# EAGLE design oled_i2c (EAGLE 6.5.0)
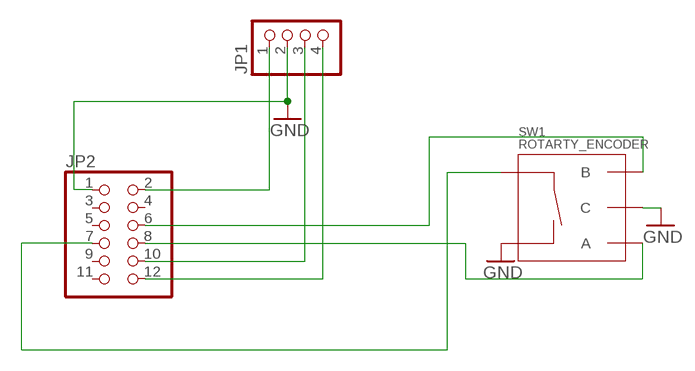
[diagram p0: schematic, sheet 1]

## Parts
JP1  PINHD-1X4  [1X04]
JP2  PINHD-2X6  [2X06]
SW1  ROTARTY_ENCODER  [ROTARY_ENC_PLAIN]

## Nets
GND: JP1.2 JP2.1 SW1.C SW1.SW-
N$1: JP2.7 SW1.SW+
N$2: JP1.1 JP2.2
N$3: JP1.3 JP2.10
N$4: JP1.4 JP2.12
N$6: JP2.6 SW1.B
N$7: JP2.8 SW1.A
Unconnected: JP2.3 JP2.4 JP2.5 JP2.9 JP2.11

## Library data of the parts
JP1 = pinhead:PINHD-1X4: PIN HEADER
JP2 = pinhead:PINHD-2X6: PIN HEADER
SW1 = SparkFun-Electromechanical:ROTARTY_ENCODER: Simple no LED rotary encoder Example: COM-09117

## Board
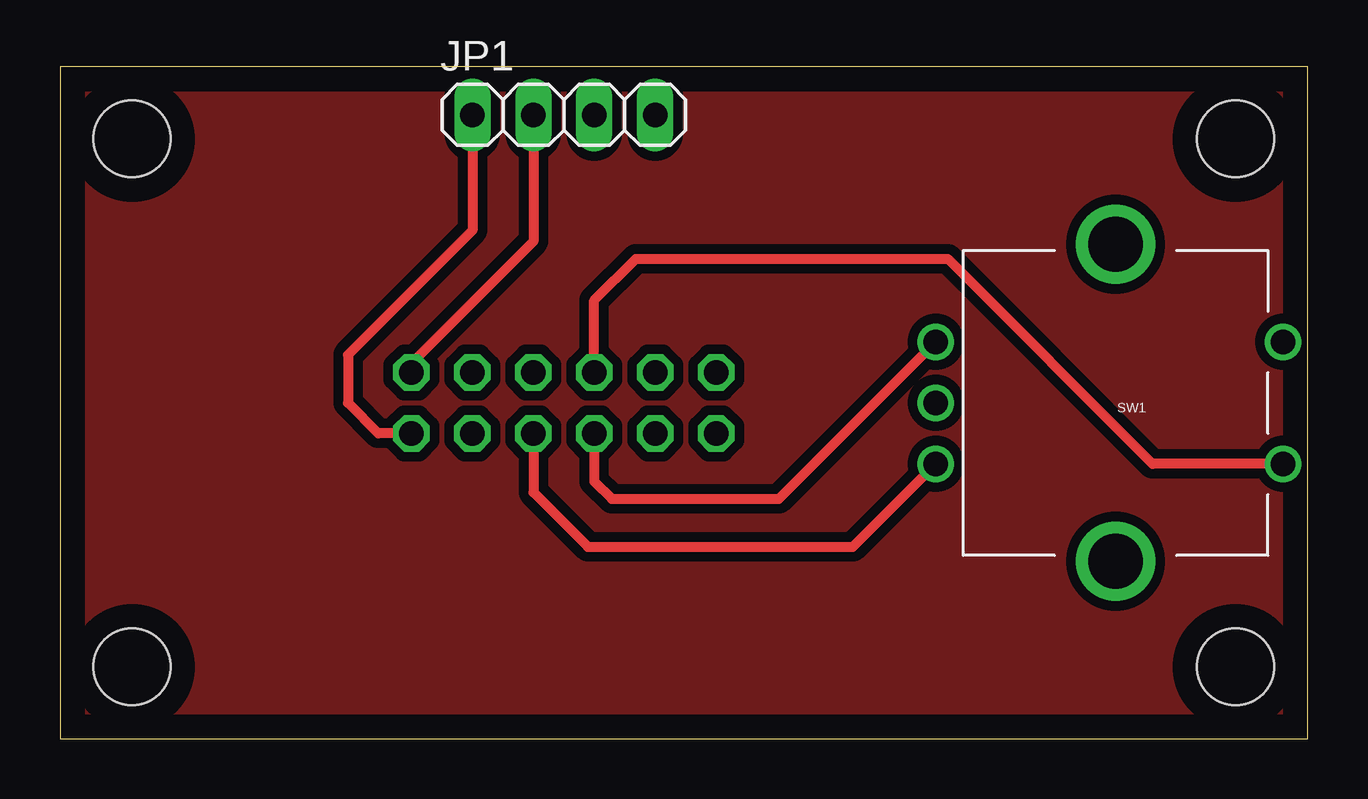
[diagram p1: board, top side]
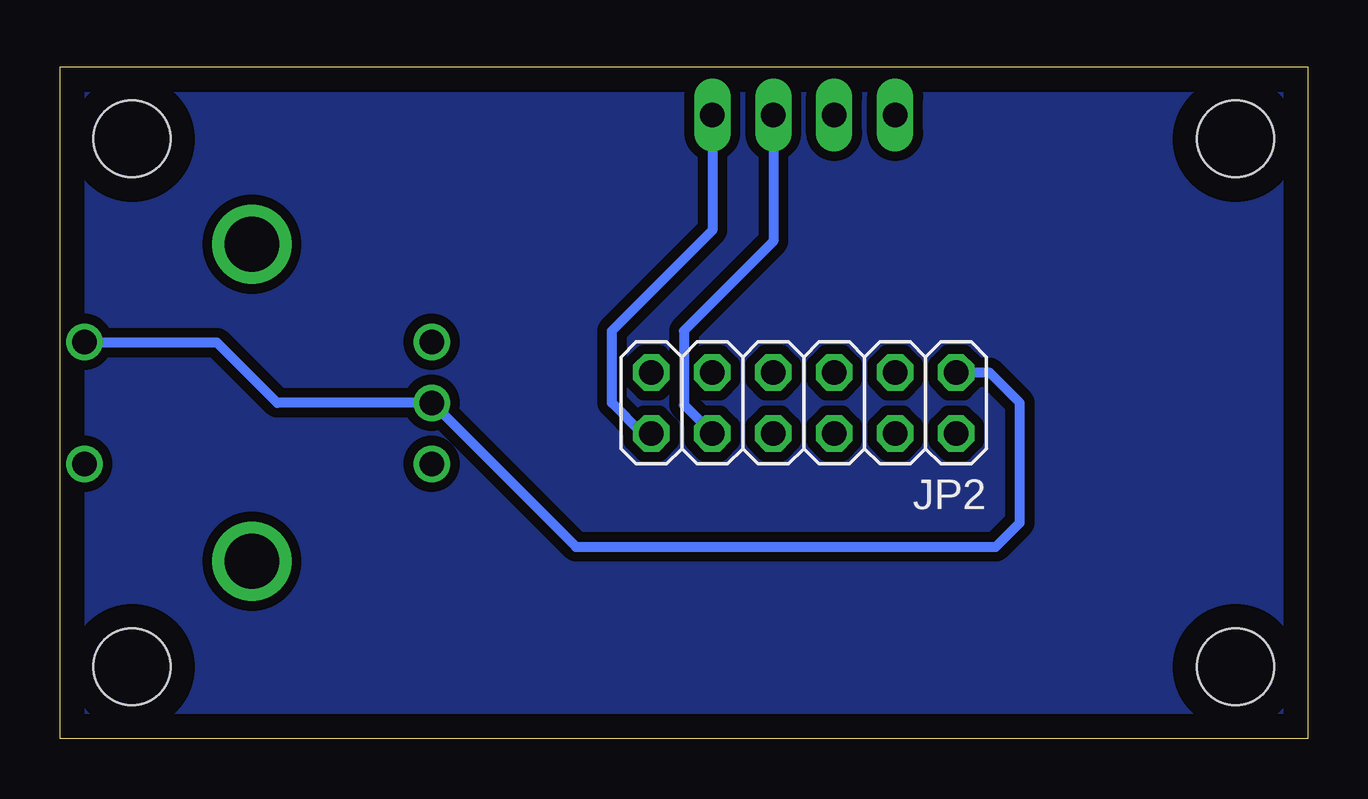
[diagram p2: board, bottom side, seen from below]

Size 52 x 28 mm. Coordinates in mm from the lower left corner, seen from the top.
Outline: 0,0 52,0 52,28 0,28 0,0
Copper layers (1*16): Top 0.035mm / dielectric 1.5mm / Bottom 0.035mm
Design rules "default": minimum track width 10mil, minimum drill 24mil, track to track 8mil, track to pad 8mil, pad to pad 8mil, via to via 8mil, smd to smd 8mil, copper to edge 40mil, drill to drill 8mil, minimum pad ring 10mil, minimum via ring 8mil, stop-mask expansion 4mil, vias tented up to drill 0mil, thermal gap 10mil
Holes 3.2 mm at 3,25 3,3 49,25 49,3

### Footprints (pad centres in the part's own frame; a part is rotated, then mirrored left to right if it is on the bottom)
1X04 = drill 1.016 long: 1 -3.81,0; 2 -1.27,0; 3 1.27,0; 4 3.81,0
2X06 = drill 1.016 octagon: 1 -6.35,-1.27; 2 -6.35,1.27; 3 -3.81,-1.27; 4 -3.81,1.27; 5 -1.27,-1.27; 6 -1.27,1.27; 7 1.27,-1.27; 8 1.27,1.27; 9 3.81,-1.27; 10 3.81,1.27; 11 6.35,-1.27; 12 6.35,1.27
ROTARY_ENC_PLAIN = drill 1.016: A 7.493,-2.54; B 7.493,2.54; C 7.493,0; SW+ -6.985,2.54; SW- -6.985,-2.54 | drill 2.286: P$3 0,6.604; P$4 0,-6.604

### Placement (x,y rotation side)
JP1  21,26 0 top
JP2  21,14 180 bottom
SW1  44,14 180 top

### Tracks (layer width: path | path; a pad name or v marks a point on that pad's centre or on a via)
GND
  Top 0.406: JP2.1 14.65,15.65 19.73,20.73 JP1.2
  Bottom 0.406: SW1.SW- 50.95,16.51 45.45,16.51 42.94,14 SW1.C 30.5,8 13,8 12,9 12,14 13.27,15.27 JP2.1
N$1
  Top 0.406: JP2.7 22.27,18.27 24,20 37,20 45.54,11.46 SW1.SW+
N$2
  Top 0.406: JP2.2 13.27,12.73 12,14 12,16 17.19,21.19 JP1.1
N$3
  Bottom 0.406: JP1.3 22.27,20.73 26,17 26,13.92 JP2.10
N$4
  Bottom 0.406: JP1.4 24.81,21.19 29,17 29,14 27.73,12.73 JP2.12
N$6
  Top 0.406: JP2.6 19.73,10.27 22,8 33.05,8 SW1.B
N$7
  Top 0.406: SW1.A 29.97,10 23,10 22.27,10.73 JP2.8
N$13
  pour Top (isolate 0.406): 1,27 51,27 51,1 1,1
N$14
  pour Bottom (isolate 0.406): 1,27 51,27 51,1 1,1

### Text on the board
tOrigins: Vcc | Gnd | SCL | SDA | TinyBoy2 / OLED Controller